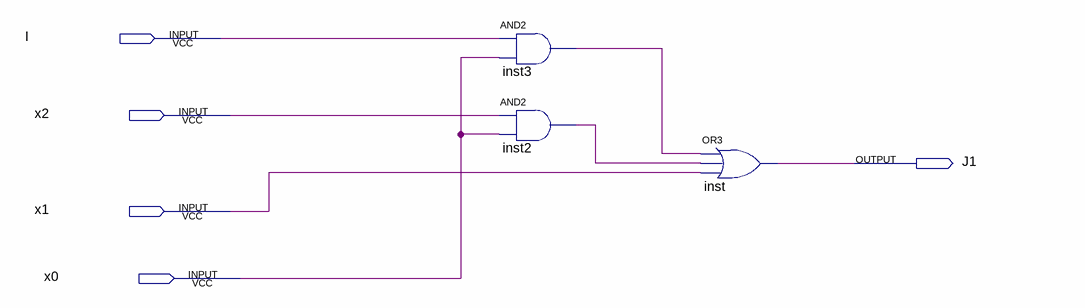
[diagram p0: schematic sheet]
// Quartus schematic J1.bdf as structural Verilog: 3 symbols, 5 pins
module J1 (
  input  I,
  input  x2,
  input  x1,
  input  x0,
  output J1
);

  wire inst2_out, inst3_out;

  and inst3 (inst3_out, I, x0);
  and inst2 (inst2_out, x2, x0);
  or inst (J1, inst3_out, inst2_out, x1);
endmodule
